# Altium schematic sheet interface.SchDoc
size A4; Organization: Arribada Initiative; Address1: https://github.com/arribada; Address2: contact@arribada.org; Address3: arribada.org; Address4: UK - Portsmouth; DocumentNumber: 10; SheetNumber: 10; SheetTotal: 13
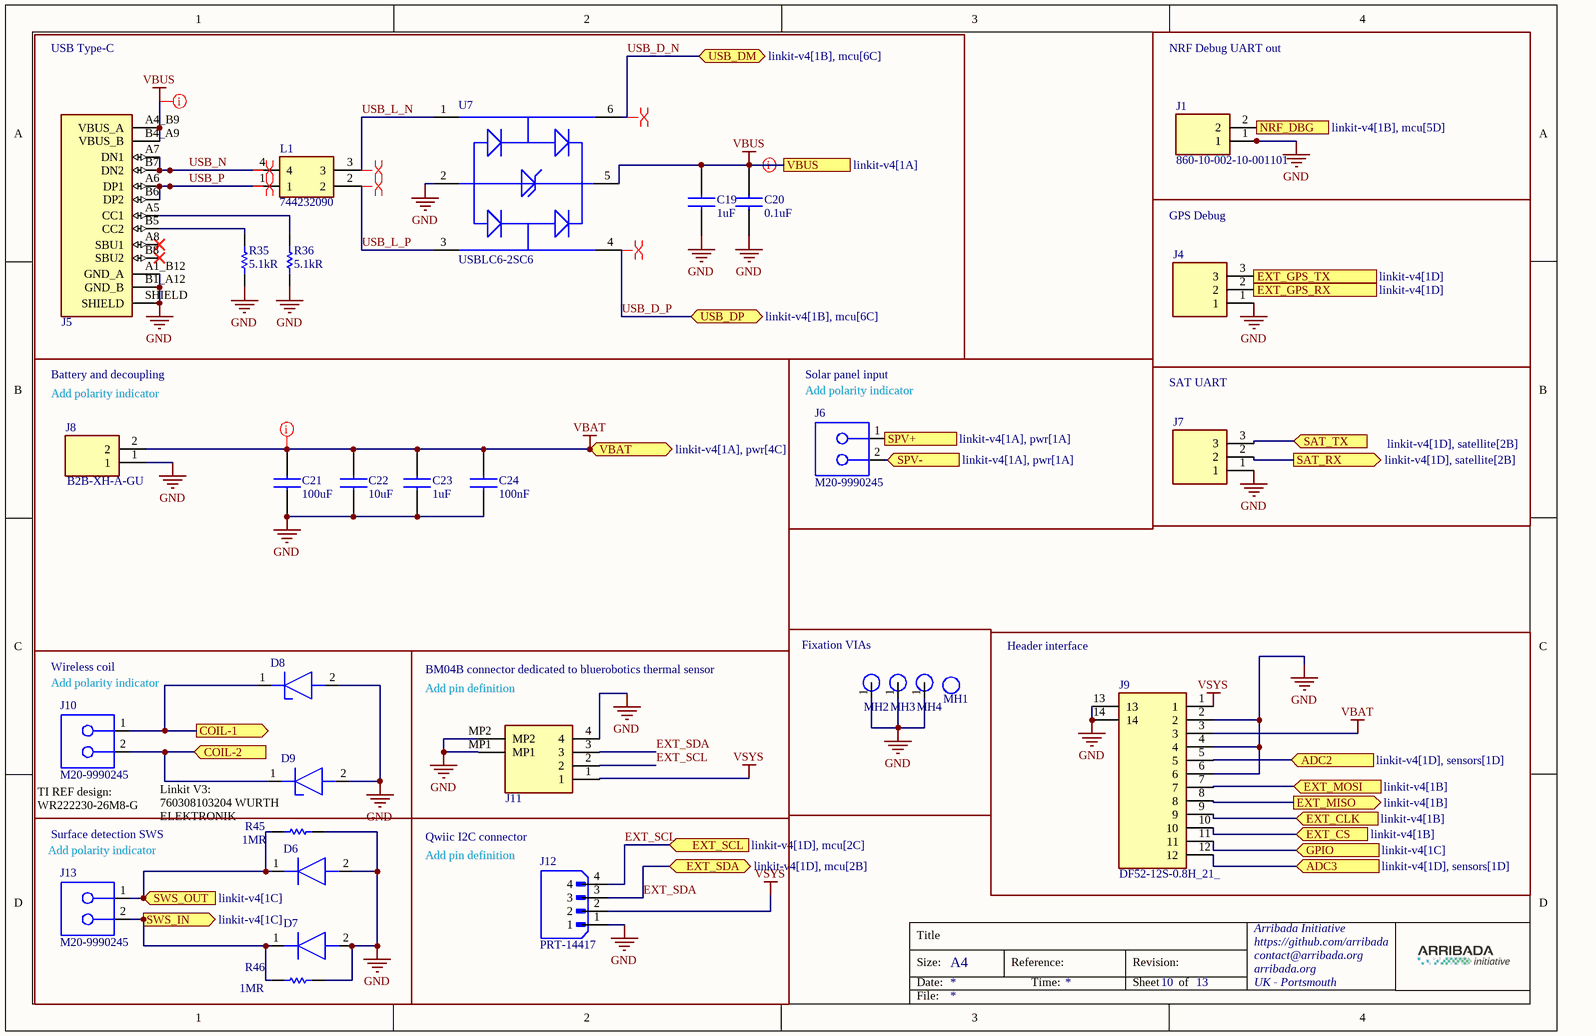
[diagram p0: interface.SchDoc]

## Parts
C19  1uF  [CAPC0603X35N]
C20  value 0.1uF  [CAPC0603X33N]  (hidden comment: 100nF)
C21  value 100uF  [CAPC3216X180N]  (hidden comment: GRM31CR61A107MEA8L)
C22  value 10uF  [CAPC1005X55N]  (hidden comment: GRM155R61A106ME11D)
C23  value 1uF  [CAPC1005X55N]  (hidden comment: GRM155R61E105KE11D)
C24  value 100nF  [0402]  (hidden comment: GRM155R71C104KA88D)
D6  ESD9L5.0ST5GH  [SODFL1006X40N]  (value not drawn)
D7  ESD9L5.0ST5GH  [SODFL1006X40N]  (value not drawn)
D8  PESD12VS1UL,315  [PESD5V0S1BL315]  (value not drawn)
D9  PESD12VS1UL,315  [PESD5V0S1BL315]  (value not drawn)
J1  860-10-002-10-001101  [8601000210001101]
J4  BC020-03-A-0200-0300-L-G  [BC02003A02000300LG]  (value not drawn)
J5  USB4215-03-A_REVA  [GCT_USB4215-03-A_REVA]  (value not drawn)
J6  M20-9990245  [HDR 2POS 2.54MM THRU HOLE]
J7  BC020-03-A-0200-0300-L-G  [BC02003A02000300LG]  (value not drawn)
J8  B2B-XH-A-GU  [B2BXHAGU]
J9  DF52-12S-0.8H_21_  [DF5212S08H21]
J10  M20-9990245  [HDR 2POS 2.54MM THRU HOLE]
J11  BM04B-GHS-TBT_LF__SN__N_  [CONN_BM04B-GHS-TBT_JST]  (value not drawn)
J12  PRT-14417  [SPARKFUN_PRT-14417]
J13  M20-9990245  [HDR 2POS 2.54MM THRU HOLE]
L1  744232090  [WE-CNSW-SMD]
MH1  Mounting Hole M2  [MOUNTING HOLE M2 UNPLATED]  (value not drawn)
MH2  Mounting Hole M2 Plated  [Mounting Hole M2 Plated]  (value not drawn)
MH3  Mounting Hole M2 Plated  [Mounting Hole M2 Plated]  (value not drawn)
MH4  Mounting Hole M2 Plated  [Mounting Hole M2 Plated]  (value not drawn)
R35  value 5.1kR  [RESC0603X28N]  (hidden comment: CRCW02015K10JNED)
R36  value 5.1kR  [RESC0603X28N]  (hidden comment: CRCW02015K10JNED)
R45  value 1MR  [RESC0603X26N]  (hidden comment: RC0201FR-7D1ML)
R46  value 1MR  [RESC0603X26N]  (hidden comment: RC0201FR-7D1ML)
U7  USBLC6-2SC6  [SOT95P280X145-6N]

## Blocks framed on the sheet
NRF Debug UART out: J1
USB Type-C: C19 C20 J5 L1 R35 R36 U7
GPS Debug: J4
SAT UART: J7
Fixation VIAs: MH1-MH4
Header interface: J9

## Ports
ADC2 (in, see linkit-v4[1D], sensors[1D]), ADC3 (in, see linkit-v4[1D], sensors[1D]), COIL-1 (out, see linkit-v4[1A], BQ51003YFPT_WirelessCharger_2.5W[1B], pwr[1C]), COIL-2 (in, see linkit-v4[1A], BQ51003YFPT_WirelessCharger_2.5W[1C], pwr[1C]), EXT_CLK (in, see linkit-v4[1B]), EXT_CS (in, see linkit-v4[1B]), EXT_GPS_RX (in, see linkit-v4[1D]), EXT_GPS_TX (in, see linkit-v4[1D]), EXT_MISO (out, see linkit-v4[1B]), EXT_MOSI (in, see linkit-v4[1B]), EXT_SCL (in, see linkit-v4[1D], mcu[2C]), EXT_SDA (bidir, see linkit-v4[1D], mcu[2B]), GPIO (in, see linkit-v4[1C]), NRF_DBG (in, see linkit-v4[1B], mcu[5D]), SAT_RX (out, see linkit-v4[1D], satellite[2B]), SAT_TX (in, see linkit-v4[1D], satellite[2B]), SPV+ (out, see linkit-v4[1A], pwr[1A]), SPV- (in, see linkit-v4[1A], pwr[1A]), SWS_IN (out, see linkit-v4[1C]), SWS_OUT (in, see linkit-v4[1C]), USB_DM (bidir, see linkit-v4[1B], mcu[6C]), USB_DP (bidir, see linkit-v4[1B], mcu[6C]), VBAT (bidir, see linkit-v4[1A], pwr[4C]), VBUS (see linkit-v4[1A])

## Nets
GND: C19.1 C20.1 C21.1 C22.2 C23.2 C24.2 D6.2(A) D7.2(A) D8.2(A) D9.2(A) J1.1 J4.1 J5.A1_B12(GND_A) J5.B1_A12(GND_B) J5.SHIELD J7.1 J8.1 J9.2 J9.4 J9.6 J9.13 J9.14 J11.4 J11.MP1 J11.MP2 J12.1 MH2.1 MH3.1 MH4.1 R35.1 R36.1 R45.2 R46.2 U7.2(GND)
VBAT: C21.2 C22.1 C23.1 C24.1 J8.2 J9.3 ; port VBAT
VBUS: C19.2 C20.2 J5.A4_B9(VBUS_A) J5.B4_A9(VBUS_B) U7.5(VBUS) ; port VBUS
VSYS: J9.1 J11.1 J12.2
ADC2: J9.5 ; port ADC2
ADC3: J9.12 ; port ADC3
COIL-1: D8.1(K) J10.1 ; port COIL-1
COIL-2: D9.1(K) J10.2 ; port COIL-2
EXT_CLK: J9.9 ; port EXT_CLK
EXT_CS: J9.10 ; port EXT_CS
EXT_GPS_RX: J4.2 ; port EXT_GPS_RX
EXT_GPS_TX: J4.3 ; port EXT_GPS_TX
EXT_MISO: J9.8 ; port EXT_MISO
EXT_MOSI: J9.7 ; port EXT_MOSI
EXT_SCL: J11.2 J12.4 ; port EXT_SCL
EXT_SDA: J11.3 J12.3 ; port EXT_SDA
GPIO: J9.11 ; port GPIO
NRF_DBG: J1.2 ; port NRF_DBG
SAT_RX: J7.2 ; port SAT_RX
SAT_TX: J7.3 ; port SAT_TX
SPV+: J6.1 ; port SPV+
SPV-: J6.2 ; port SPV-
SWS_IN: D7.1(K) J13.2 R46.1 ; port SWS_IN
SWS_OUT: D6.1(K) J13.1 R45.1 ; port SWS_OUT
USB_D_N: U7.6(I/O1_2) ; port USB_DM
USB_D_P: U7.4(I/O2_2) ; port USB_DP
USB_L_N: L1.3 U7.1(I/O1_1)
USB_L_P: L1.2 U7.3(I/O2_1)
USB_N: J5.A7(DN1) J5.B7(DN2) L1.4
USB_P: J5.A6(DP1) J5.B6(DP2) L1.1
NetJ5_A5: J5.A5(CC1) R36.2
NetJ5_B5: J5.B5(CC2) R35.2

Not connected (* = marked no-connect by the designer): J5 A8(SBU1)* B8(SBU2)*

## Layout directives
differential pair; rule Impedance Constraint [Min = 80.00    Max = 100.0    ]; differential pair class USB: USB_D_N, USB_D_P, USB_L_N, USB_L_P, USB_N, USB_P
net class Power; rule Width Constraint [Pref Width = 0.4mm    Min Width = 0.2mm    Max Width = 0.8mm]; rule Width Constraint [Pref Width = 0.4mm    Min Width = 0.2mm    Max Width = 0.8mm]; rule Width Constraint [Pref Width = 0.4mm    Min Width = 0.2mm    Max Width = 0.8mm]; rule Width Constraint [Pref Width = 0.4mm    Min Width = 0.2mm    Max Width = 0.8mm]: VBAT, VBUS

## Notes on the sheet
- Battery and decoupling
- Solar panel input
- (near J8) Add polarity indicator
- (near J6) Add polarity indicator
- (near J10) Add polarity indicator
- Wireless coil
- BM04B connector dedicated to bluerobotics thermal sensor
- (near J11) Add pin definition
- (near J10) TI REF design:
  WR222230-26M8-G
- (near J13) Add polarity indicator
- Surface detection SWS
- Linkit V3:
  760308103204 WURTH ELEKTRONIK
- Qwiic I2C connector
- Add pin definition
- Title
- Size:
- Date:
- A4
- Reference:
- Time:
- Revision:
- Sheet
- of
- File:

## Library data of the parts
C19 = CL03A105KP3NSNC: Multilayer Ceramic Capacitors MLCC - SMD/SMT 1uF+/-10% 10V X5R 06 0201; Manufacturer_Name: SAMSUNG; Geometry.Height: 0.35mm; Mouser Part Number: 187-CL03A105KP3NSNC; Mouser Price/Stock: https://www.mouser.co.uk/ProductDetail/Samsung-Electro-Mechanics/CL03A105KP3NSNC?qs=47mY1nHWefQ3GOjXGTFrfg%3D%3D; Manufacturer_Part_Number: CL03A105KP3NSNC; Datasheet Link: https://datasheet.datasheetarchive.com/originals/distributors/DKDS-19/372696.pdf; Value: 1uF
C20 = GRM033Z71C104KE14D: Multilayer Ceramic Capacitors MLCC - SMD/SMT .1UF     16V   10%        0201; Manufacturer_Name: Murata Electronics; Manufacturer 1: Murata; Geometry.Height: 0.33mm; Description 1: Cap Ceramic 0.1uF 16V X7R 10% Pad SMD 0201 125C T/R; Mouser Part Number: 81-GRM033Z71C104KE4D; Mouser Price/Stock: https://www.mouser.co.uk/ProductDetail/Murata-Electronics/GRM033Z71C104KE14D?qs=lEfY3O89AqkdMqrSfAAk2w%3D%3D; Manufacturer_Part_Number: GRM033Z71C104KE14D; Datasheet Link: http://www.murata.com/~/media/webrenewal/support/library/catalog/products/capacitor/mlcc/c02e.pdf; Supplier 1: Mouser; Supplier Part Number 1: 81-GRM033Z71C104KE4D; Manufacturer Part Number 1: GRM033Z71C104KE14D; RoHS 1: Yes; Category 1: Ceramic Capacitors; Stock 1: 739403; Pricing 1: 1=0,1, 10=0,017, 50=0,017, 100=0,01, 1000=0,008, 10000=0,006 (USD); Case/Package: 0201; RoHS Compliant: Yes
C21 = GRM31CR61A107MEA8L: Multilayer Ceramic Capacitors MLCC - SMD/SMT 100 uF 10 VDC 20% 1206 X5R; Manufacturer_Name: Murata Electronics; Datasheet Link: http://www.murata.com/~/media/webrenewal/support/library/catalog/products/capacitor/mlcc/c02e.pdf; Height: 1.8mm; Manufacturer_Part_Number: GRM31CR61A107MEA8L; Mouser Part Number: 81-GRM31CR61A107MA8L; Mouser Price/Stock: https://www.mouser.co.uk/ProductDetail/Murata-Electronics/GRM31CR61A107MEA8L?qs=hd1VzrDQEGidurXiDTJOCg%3D%3D; Arrow Part Number: GRM31CR61A107MEA8L; Arrow Price/Stock: https://www.arrow.com/en/products/grm31cr61a107mea8l/murata-manufacturing?region=nac
C22 = GRM155R61A106ME11D: Multilayer Ceramic Capacitors MLCC - SMD/SMT 10 uF 10 VDC 20% 0402 X5R; Manufacturer_Name: Murata Electronics; Datasheet Link: http://www.murata.com/~/media/webrenewal/support/library/catalog/products/capacitor/mlcc/c02e.pdf; Height: 0.55mm; Manufacturer_Part_Number: GRM155R61A106ME11D; Mouser Part Number: 81-GRM155R61A106ME1D; Mouser Price/Stock: https://www.mouser.co.uk/ProductDetail/Murata-Electronics/GRM155R61A106ME11D?qs=xZ%2FP%252Ba9zWqZMJSi57Q8OyA%3D%3D; Arrow Part Number: GRM155R61A106ME11D; Arrow Price/Stock: https://www.arrow.com/en/products/grm155r61a106me11d/murata-manufacturing?region=nac
C23 = GRM155R61E105KE11D: Multilayer Ceramic Capacitors MLCC - SMD/SMT 1 uF 25 VDC 10% 0402 X5R; Manufacturer_Name: Murata Electronics; Datasheet Link: http://www.murata.com/~/media/webrenewal/support/library/catalog/products/capacitor/mlcc/c02e.pdf; Height: 0.55mm; Manufacturer_Part_Number: GRM155R61E105KE11D; Mouser Part Number: 81-GRM155R61E105KE1D; Mouser Price/Stock: https://www.mouser.co.uk/ProductDetail/Murata-Electronics/GRM155R61E105KE11D?qs=QzBtWTOodeUQ00WJlpqFiw%3D%3D; Arrow Part Number: GRM155R61E105KE11D; Arrow Price/Stock: https://www.arrow.com/en/products/grm155r61e105ke11d/murata-manufacturing?region=nac
C24 = GRM155R71C104KA88D: Multilayer Ceramic Capacitors MLCC - SMD/SMT 0.1 uF 16 VDC 10% 0402 X7R; Manufacturer_Part_Number: CC0402KRX7R7BB104; Manufacturer: YAGEO; Manufacturer 1: Murata; Description 1: 0402 0.1 uF 16V ±10 % Tolerance X7R SMT Multilayer Ceramic Capacitor; Voltage Rating: 16V; Package: C0402; Supplier 1: Mouser; Supplier Part Number 1: 81-GRM155R71C104KA88; Manufacturer Part Number 1: GRM155R71C104KA88D; RoHS 1: Yes; Category 1: Ceramic Capacitors; Stock 1: 7816691; Pricing 1: 1=0,1, 10=0,017, 50=0,017, 100=0,01, 1000=0,008, 10000=0,005 (USD); Mount: Surface Mount; Case/Package: 0402; Number of Pins: 2; Case Code (Metric): 1005; Case Code (Imperial): 0402; Material: Ceramic; Dielectric Material: Ceramic; Min Operating Temperature: -55°C; Max Operating Temperature: 125°C; Capacitance: 100nF; Tolerance: 10%; Packaging: Tape and Reel; Voltage Rating (DC): 16V; Package Quantity: 1; Dielectric: X7R; Termination: SMD/SMT; Voltage: 16V; Series: GRM; Length: 1mm; Width: 0.02inch; Height: 0.5mm; Thickness: 0.022inch; Depth: 0.5mm; Radiation Hardening: No; Lead Free: Lead Free; RoHS Compliant: Yes; Reach SVHC Compliant: Unknown; ComponentLink1URL: https://datasheet.ciiva.com/129/grm155r71c104ka88-01-129739.pdf?src-supplier=Digi-Key; ComponentLink1Description: https://datasheet.ciiva.com/129/grm155r71c104ka88-01-129739.pdf?src-supplier=Digi-Key; ComponentLink2URL: https://datasheet.ciiva.com/129/grm155r71c104ka88-01-129740.pdf?src-supplier=Digi-Key; ComponentLink2Description: https://datasheet.ciiva.com/129/grm155r71c104ka88-01-129740.pdf?src-supplier=Digi-Key; ComponentLink3URL: https://datasheet.ciiva.com/29199/454098-da-01-en-vs-kondensator-0402-29199799.pdf?src-supplier=Conrad; ComponentLink3Description: https://datasheet.ciiva.com/29199/454098-da-01-en-vs-kondensator-0402-29199799.pdf?src-supplier=Conrad; ComponentLink4URL: https://datasheet.ciiva.com/7937/4360-7937615.pdf?src-supplier=Element14; ComponentLink4Description: https://datasheet.ciiva.com/7937/4360-7937615.pdf?src-supplier=Element14; ComponentLink5URL: https://datasheet.ciiva.com/14116/grmseries-highdielectrictype-eng-14116878.pdf?src-supplier=Distrelec; ComponentLink5Description: https://datasheet.ciiva.com/14116/grmseries-highdielectrictype-eng-14116878.pdf?src-supplier=Distrelec; ComponentLink6URL: https://datasheet.ciiva.com/14103/grmseries-highdielectrictype-eng-14103750.pdf?src-supplier=Distrelec; ComponentLink6Description: https://datasheet.ciiva.com/14103/grmseries-highdielectrictype-eng-14103750.pdf?src-supplier=Distrelec; ComponentLink7URL: https://datasheet.ciiva.com/28534/4360-28534127.pdf?src-supplier=Element14; ComponentLink7Description: https://datasheet.ciiva.com/28534/4360-28534127.pdf?src-supplier=Element14; ComponentLink8URL: https://datasheet.ciiva.com/28534/4360-28534133.pdf?src-supplier=Element14; ComponentLink8Description: https://datasheet.ciiva.com/28534/4360-28534133.pdf?src-supplier=Element14
D6 D7 = ESD9L5.0ST5GH: Diode; Manufacturer_Name: onsemi; Datasheet Link: https://www.onsemi.com/pdf/datasheet/esd9l-d.pdf; Height: 0.4mm; Manufacturer_Part_Number: ESD9L5.0ST5GH
D8 D9 = PESD12VS1UL,315: Diode ESD (Uni-directional); Manufacturer_Name: Nexperia; Datasheet Link: https://assets.nexperia.com/documents/data-sheet/PESD12VS1UL.pdf; Height: 0mm; Manufacturer_Part_Number: PESD12VS1UL,315; Mouser Part Number: 771-PESD12VS1UL315; Mouser Price/Stock: https://www.mouser.co.uk/ProductDetail/Nexperia/PESD12VS1UL315?qs=LOCUfHb8d9vNAqHjzC5o%2FA%3D%3D; Arrow Part Number: PESD12VS1UL,315; Arrow Price/Stock: https://www.arrow.com/en/products/pesd12vs1ul315/nexperia?utm_currency=USD&region=nac
J1 = 860-10-002-10-001101: Connector, Header 2 pos, 1 row, pitch 1mm; Manufacturer_Name: Preci-Dip; Datasheet Link: https://www.precidip.com/AppHost/9696,1/Scripts/Modules/Catalog/Default.aspx?c=8&i=516&p=101&pdf=1&dsku=860-10-NNN-10-001101; Height: 3.63mm; Manufacturer_Part_Number: 860-10-002-10-001101; Mouser Part Number: 437-8601000210001101; Mouser Price/Stock: https://www.mouser.co.uk/ProductDetail/Preci-dip/860-10-002-10-001101?qs=jrVTBkKbt4YuZ%2FSZyJlz1w%3D%3D
J4 J7 = BC020-03-A-0200-0300-L-G: Connector; Manufacturer_Name: GCT (GLOBAL CONNECTOR TECHNOLOGY); Datasheet Link: https://www.mouser.com/datasheet/2/837/BC020-1948594.pdf; Height: 3.2mm; Manufacturer_Part_Number: BC020-03-A-0200-0300-L-G
J5 = USB4215-03-A_REVA: USB Connectors USB C Receptacle, Short Body, USB2.0, 16Pin, Horizontal, SMT; MF: Global Connector Technology; SnapEDA_Link: https://www.snapeda.com/parts/USB4215-03-A/Global+Connector+Technology/view-part/?ref=snap; Package: None; Value: *; MP: USB4215-03-A; Check_prices: https://www.snapeda.com/parts/USB4215-03-A/Global+Connector+Technology/view-part/?ref=eda
J6 J10 J13 = M20-9990245: CON HDR 2POS HEADER 2.54MM VERT THRU HOLE; Manufacturer: Harwin; Manufacturers Part Number: M20-9990245; Supplier 1: Digi-Key; Supplier 2: Mouser; Supplier Part Number 1: 952-2261-ND; Supplier Part Number 2: 855-M20-9990245; Distributor 1: EBV; Distributor 2: Future Electronics
J8 = B2B-XH-A-GU: Connector; Manufacturer_Name: JST (JAPAN SOLDERLESS TERMINALS); Datasheet Link: http://www.jst-mfg.com/product/pdf/eng/eXH.pdf; Height: 7mm; Manufacturer_Part_Number: B2B-XH-A-GU; Mouser Part Number: N/A; Mouser Price/Stock: https://www.mouser.co.uk/ProductDetail/JST-Commercial/B2B-XH-A-GU?qs=IKkN%2F947nfBVsqimfO%252BieQ%3D%3D; Arrow Part Number: B2B-XH-A-GU; Arrow Price/Stock: https://www.arrow.com/en/products/b2b-xh-a-gu/jst-manufacturing?utm_currency=USD&region=europe
J9 = DF52-12S-0.8H_21_: Headers & Wire Housings Recep 12P R/A 0.8mm Pitch; Manufacturer_Name: Hirose; Manufacturer_Part_Number: DF52-12S-0.8H(21); Datasheet Link: https://www.hirose.com/product/en/products/DF52/DF52-12S-0.8H%2821%29/; Height: 1mm; Mouser Part Number: 798-DF52-12S-0.8H21; Mouser Price/Stock: https://www.mouser.co.uk/ProductDetail/Hirose-Connector/DF52-12S-0.8H21?qs=%2FKR40Cd6GUo160JXe3226w%3D%3D
J11 = BM04B-GHS-TBT_LF__SN__N_: Headers & Wire Housings GH HEADER (SMT/TOP TYPE); Manufacturer_Name: JST (JAPAN SOLDERLESS TERMINALS); Manufacturer_Part_Number: BM04B-GHS-TBT(LF)(SN)(N); Datasheet Link: http://www.jst-mfg.com/product/pdf/eng/eGH.pdf; Height: 4.05mm; Mouser Part Number: N/A; Mouser Price/Stock: https://www.mouser.co.uk/ProductDetail/JST-Commercial/BM04B-GHS-TBTLFSNN?qs=QpmGXVUTftGHKxacCgPJ1g%3D%3D; Arrow Part Number: BM04B-GHS-TBT(LF)(SN)(N); Arrow Price/Stock: https://www.arrow.com/en/products/bm04b-ghs-tbt-lf-sn-n/jst-manufacturing?region=europe
J12 = PRT-14417: QWIIC JST CONNECTOR - SMD 4-PIN; MF: SparkFun Electronics; SnapEDA_Link: https://www.snapeda.com/parts/PRT-14417/SparkFun+Electronics/view-part/?ref=snap; Package: None; Value: *; MP: PRT-14417; Check_prices: https://www.snapeda.com/parts/PRT-14417/SparkFun+Electronics/view-part/?ref=eda
L1 = 744232090: Common Mode Chokes / Filters WE-CNSW 1206 370mA 90Ohm 100MHz AECQ200; Manufacturer_Name: Wurth Elektronik; Datasheet Link: https://datasheet.datasheetarchive.com/originals/distributors/Datasheets_SAMA/c4bd373adc4470b1464be5d10e6e206e.pdf; Manufacturer_Part_Number: 744232090; Mouser Part Number: 710-744232090; Mouser Price/Stock: https://www.mouser.co.uk/ProductDetail/Wurth-Elektronik/744232090?qs=PGXP4M47uW6L5fAiLO6yTw%3D%3D
MH1 = Mounting Hole M2: Manufacturer: NOT FITTED PART; Manufacturers Part Number: NOT FITTED PART; Distributor 1: EBV; Distributor 2: Future Electronics
MH2-MH4 = Mounting Hole M2 Plated: Manufacturer: NOT FITTED PART; Manufacturers Part Number: NOT FITTED PART; Distributor 1: EBV; Distributor 2: Future Electronics
R35 R36 = CRCW02015K10JNED: Thick Film Resistors - SMD 1/20watt 5.1Kohms 5% 200ppm; Manufacturer_Name: Vishay; Datasheet Link: http://www.vishay.com/docs/20035/dcrcwe3.pdf; Height: 0.28mm; Manufacturer_Part_Number: CRCW02015K10JNED; Mouser Part Number: 71-CRCW02015K10JNED; Mouser Price/Stock: https://www.mouser.com/Search/Refine.aspx?Keyword=71-CRCW02015K10JNED
R45 R46 = RC0201FR-7D1ML: Thick Film Resistors - SMD 1 MOhms 50 mW 0201 1%; Manufacturer_Name: KEMET; Datasheet Link: http://www.yageo.com/documents/recent/PYu-RC0201_51_RoHS_L_8.pdf; Height: 0.26mm; Manufacturer_Part_Number: RC0201FR-7D1ML; Mouser Part Number: 603-RC0201FR-7D1ML; Mouser Price/Stock: https://www.mouser.co.uk/ProductDetail/YAGEO/RC0201FR-7D1ML?qs=NgbZBzc1CyEo5FlGf5N0Ug%3D%3D; Arrow Part Number: RC0201FR-7D1ML; Arrow Price/Stock: https://www.arrow.com/en/products/rc0201fr-7d1ml/yageo
U7 = USBLC6-2SC6: ESD Suppressors / TVS Diodes High Speed Interface Protection Low Cap; Manufacturer_Name: STMicroelectronics; Datasheet Link: http://www.st.com/st-web-ui/static/active/en/resource/technical/document/datasheet/CD00050750.pdf; Height: 1.45mm; Manufacturer_Part_Number: USBLC6-2SC6; Mouser Part Number: 511-USBLC6-2SC6; Mouser Price/Stock: https://www.mouser.co.uk/ProductDetail/STMicroelectronics/USBLC6-2SC6?qs=po45yt2pPpu%2FhNIlwQdTlg%3D%3D; Arrow Part Number: USBLC6-2SC6; Arrow Price/Stock: https://www.arrow.com/en/products/usblc6-2sc6/stmicroelectronics?utm_currency=USD&region=europe